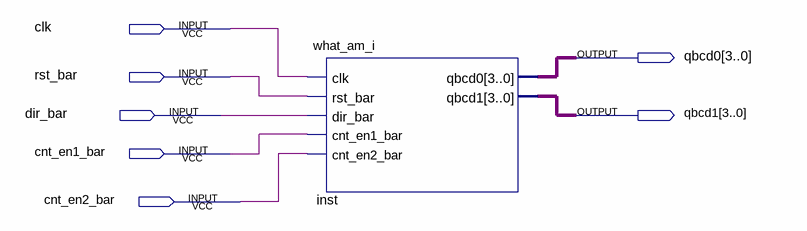
[diagram p0: schematic sheet]
// Quartus schematic Mod32Counter.bdf as structural Verilog: 1 symbols, 7 pins
module Mod32Counter (
  input  clk,
  input  rst_bar,
  input  dir_bar,
  input  cnt_en1_bar,
  input  cnt_en2_bar,
  output [3:0] qbcd0,
  output [3:0] qbcd1
);

  what_am_i inst (
    .clk(clk), .rst_bar(rst_bar), .dir_bar(dir_bar), .cnt_en1_bar(cnt_en1_bar), .cnt_en2_bar(cnt_en2_bar),
    .qbcd0(qbcd0), .qbcd1(qbcd1));
endmodule
